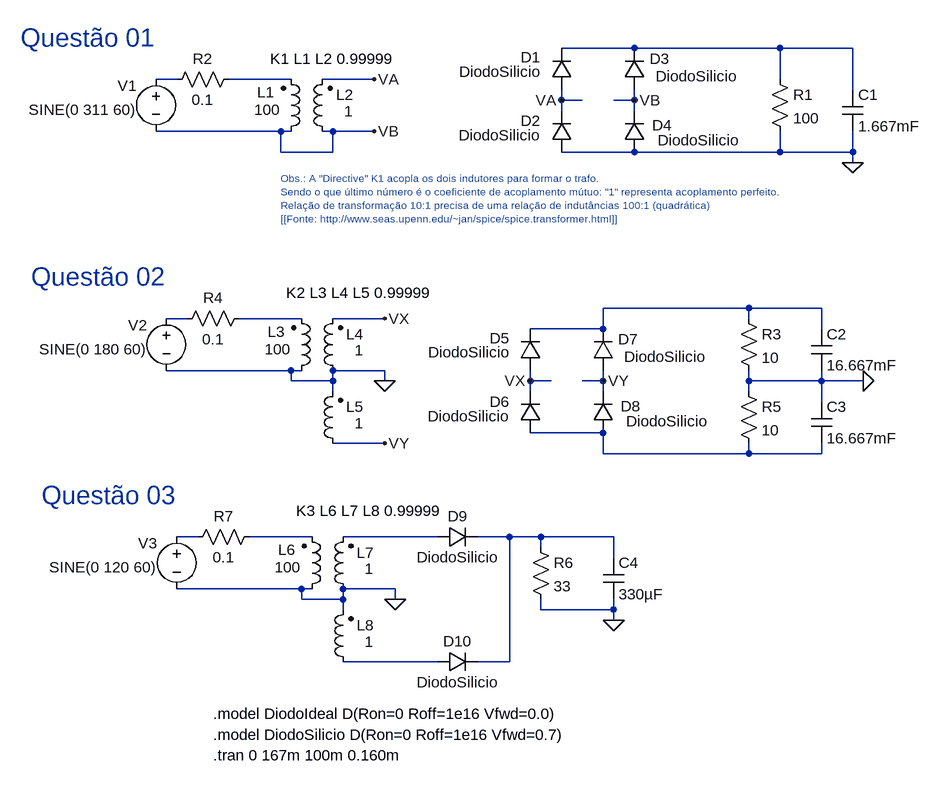
[diagram p0: schematic Tutorial_LTSpice_Ep8-Transformador.asc]
Tutorial_LTSpice_Ep8-Transformador.asc, the LTspice schematic file:
Version 4
SHEET 1 2300 1300
WIRE 672 -32 560 -32
WIRE 896 -32 672 -32
WIRE 1008 -32 896 -32
WIRE -32 16 -64 16
WIRE 144 16 48 16
WIRE 272 16 192 16
WIRE 896 16 896 -32
WIRE 1008 32 1008 -32
WIRE 560 48 560 32
WIRE 592 48 560 48
WIRE 672 48 672 32
WIRE 672 48 640 48
WIRE 560 64 560 48
WIRE 672 64 672 48
WIRE 128 96 -64 96
WIRE 144 96 128 96
WIRE 208 96 192 96
WIRE 272 96 208 96
WIRE 128 128 128 96
WIRE 208 128 208 96
WIRE 208 128 128 128
WIRE 672 128 560 128
WIRE 896 128 896 96
WIRE 896 128 672 128
WIRE 1008 128 1008 96
WIRE 1008 128 896 128
WIRE 1008 144 1008 128
WIRE 848 368 624 368
WIRE 960 368 848 368
WIRE -16 384 -48 384
WIRE 160 384 64 384
WIRE 288 384 208 384
WIRE 848 384 848 368
WIRE 624 400 624 368
WIRE 624 400 512 400
WIRE 960 400 960 368
WIRE 144 464 -48 464
WIRE 160 464 144 464
WIRE 288 464 208 464
WIRE 144 480 144 464
WIRE 208 480 208 464
WIRE 208 480 144 480
WIRE 288 480 288 464
WIRE 512 480 512 464
WIRE 544 480 512 480
WIRE 624 480 624 464
WIRE 624 480 592 480
WIRE 848 480 848 464
WIRE 960 480 960 464
WIRE 960 480 848 480
WIRE 1024 480 960 480
WIRE 208 496 208 480
WIRE 512 496 512 480
WIRE 624 496 624 480
WIRE 848 496 848 480
WIRE 960 512 960 480
WIRE 624 560 512 560
WIRE 288 576 208 576
WIRE 624 592 624 560
WIRE 848 592 848 576
WIRE 848 592 624 592
WIRE 960 592 960 576
WIRE 960 592 848 592
WIRE 0 720 -32 720
WIRE 176 720 80 720
WIRE 368 720 224 720
WIRE 480 720 432 720
WIRE 528 720 480 720
WIRE 640 720 528 720
WIRE 528 736 528 720
WIRE 640 752 640 720
WIRE 160 800 -32 800
WIRE 176 800 160 800
WIRE 304 800 224 800
WIRE 160 816 160 800
WIRE 224 816 224 800
WIRE 224 816 160 816
WIRE 304 816 304 800
WIRE 224 832 224 816
WIRE 528 832 528 816
WIRE 640 832 640 816
WIRE 640 832 528 832
WIRE 640 848 640 832
WIRE 368 912 224 912
WIRE 480 912 480 720
WIRE 480 912 432 912
FLAG 1008 144 0
FLAG 272 16 VA
FLAG 560 48 VA
FLAG 672 48 VB
FLAG 272 96 VB
FLAG 1024 480 0
FLAG 288 384 VX
FLAG 512 480 VX
FLAG 624 480 VY
FLAG 288 576 VY
FLAG 288 480 0
FLAG 640 848 0
FLAG 304 816 0
SYMBOL voltage -64 0 R0
WINDOW 123 0 0 Left 2
WINDOW 39 0 0 Left 2
WINDOW 0 -59 26 Left 2
WINDOW 3 -196 63 Left 2
SYMATTR InstName V1
SYMATTR Value SINE(0 311 60)
SYMBOL ind2 128 112 M180
WINDOW 0 -36 76 Left 2
WINDOW 3 -41 49 Left 2
SYMATTR InstName L1
SYMATTR Value 100
SYMATTR Type ind
SYMBOL ind2 208 112 R180
WINDOW 0 -32 72 Left 2
WINDOW 3 -31 47 Left 2
SYMATTR InstName L2
SYMATTR Value 1
SYMATTR Type ind
SYMATTR SpiceLine Rser=0
SYMBOL diode 576 32 R180
WINDOW 0 48 50 Left 2
WINDOW 3 48 28 Left 2
SYMATTR InstName D1
SYMATTR Value DiodoSilicio
SYMBOL diode 576 128 R180
WINDOW 0 48 48 Left 2
WINDOW 3 49 26 Left 2
SYMATTR InstName D2
SYMATTR Value DiodoSilicio
SYMBOL diode 688 32 R180
WINDOW 0 -38 48 Left 2
WINDOW 3 -142 21 Left 2
SYMATTR InstName D3
SYMATTR Value DiodoSilicio
SYMBOL diode 688 128 R180
WINDOW 0 -42 41 Left 2
WINDOW 3 -145 18 Left 2
SYMATTR InstName D4
SYMATTR Value DiodoSilicio
SYMBOL res 880 0 R0
SYMATTR InstName R1
SYMATTR Value 100
SYMBOL res 64 0 R90
WINDOW 0 0 56 VBottom 2
WINDOW 3 32 56 VTop 2
SYMATTR InstName R2
SYMATTR Value 0.1
SYMBOL cap 992 32 R0
SYMATTR InstName C1
SYMATTR Value 1.667mF
SYMBOL voltage -48 368 R0
WINDOW 123 0 0 Left 2
WINDOW 39 0 0 Left 2
WINDOW 0 -59 26 Left 2
WINDOW 3 -196 63 Left 2
SYMATTR InstName V2
SYMATTR Value SINE(0 180 60)
SYMBOL ind2 144 480 M180
WINDOW 0 -36 76 Left 2
WINDOW 3 -41 49 Left 2
SYMATTR InstName L3
SYMATTR Value 100
SYMATTR Type ind
SYMBOL ind2 224 480 R180
WINDOW 0 -32 72 Left 2
WINDOW 3 -31 47 Left 2
SYMATTR InstName L4
SYMATTR Value 1
SYMATTR Type ind
SYMATTR SpiceLine Rser=0
SYMBOL diode 528 464 R180
WINDOW 0 48 50 Left 2
WINDOW 3 48 28 Left 2
SYMATTR InstName D5
SYMATTR Value DiodoSilicio
SYMBOL diode 528 560 R180
WINDOW 0 48 48 Left 2
WINDOW 3 49 26 Left 2
SYMATTR InstName D6
SYMATTR Value DiodoSilicio
SYMBOL diode 640 464 R180
WINDOW 0 -38 48 Left 2
WINDOW 3 -142 21 Left 2
SYMATTR InstName D7
SYMATTR Value DiodoSilicio
SYMBOL diode 640 560 R180
WINDOW 0 -42 41 Left 2
WINDOW 3 -145 18 Left 2
SYMATTR InstName D8
SYMATTR Value DiodoSilicio
SYMBOL res 832 368 R0
SYMATTR InstName R3
SYMATTR Value 10
SYMBOL res 80 368 R90
WINDOW 0 0 56 VBottom 2
WINDOW 3 32 56 VTop 2
SYMATTR InstName R4
SYMATTR Value 0.1
SYMBOL cap 944 400 R0
SYMATTR InstName C2
SYMATTR Value 16.667mF
SYMBOL ind2 224 592 R180
WINDOW 0 -32 72 Left 2
WINDOW 3 -31 47 Left 2
SYMATTR InstName L5
SYMATTR Value 1
SYMATTR Type ind
SYMATTR SpiceLine Rser=0
SYMBOL res 832 480 R0
SYMATTR InstName R5
SYMATTR Value 10
SYMBOL cap 944 512 R0
SYMATTR InstName C3
SYMATTR Value 16.667mF
SYMBOL voltage -32 704 R0
WINDOW 123 0 0 Left 2
WINDOW 39 0 0 Left 2
WINDOW 0 -59 26 Left 2
WINDOW 3 -196 63 Left 2
SYMATTR InstName V3
SYMATTR Value SINE(0 120 60)
SYMBOL ind2 160 816 M180
WINDOW 0 -36 76 Left 2
WINDOW 3 -41 49 Left 2
SYMATTR InstName L6
SYMATTR Value 100
SYMATTR Type ind
SYMBOL ind2 240 816 R180
WINDOW 0 -32 72 Left 2
WINDOW 3 -31 47 Left 2
SYMATTR InstName L7
SYMATTR Value 1
SYMATTR Type ind
SYMATTR SpiceLine Rser=0
SYMBOL diode 368 736 R270
WINDOW 0 32 32 VTop 2
WINDOW 3 0 32 VBottom 2
SYMATTR InstName D9
SYMATTR Value DiodoSilicio
SYMBOL diode 368 928 R270
WINDOW 0 32 32 VTop 2
WINDOW 3 0 32 VBottom 2
SYMATTR InstName D10
SYMATTR Value DiodoSilicio
SYMBOL res 512 720 R0
SYMATTR InstName R6
SYMATTR Value 33
SYMBOL res 96 704 R90
WINDOW 0 0 56 VBottom 2
WINDOW 3 32 56 VTop 2
SYMATTR InstName R7
SYMATTR Value 0.1
SYMBOL cap 624 752 R0
SYMATTR InstName C4
SYMATTR Value 330µF
SYMBOL ind2 240 928 R180
WINDOW 0 -32 72 Left 2
WINDOW 3 -31 47 Left 2
SYMATTR InstName L8
SYMATTR Value 1
SYMATTR Type ind
SYMATTR SpiceLine Rser=0
TEXT 24 1056 Left 2 !.tran 0 167m 100m 0.160m
TEXT -272 -48 Left 4 ;Questão 01
TEXT 24 992 Left 2 !.model DiodoIdeal D(Ron=0 Roff=1e16 Vfwd=0.0)
TEXT 24 1024 Left 2 !.model DiodoSilicio D(Ron=0 Roff=1e16 Vfwd=0.7)
TEXT 112 -16 Left 2 !K1 L1 L2 0.99999
TEXT 128 168 Left 1 ;Obs.: A "Directive" K1 acopla os dois indutores para formar o trafo.\nSendo o que último número é o coeficiente de acoplamento mútuo: "1" representa acoplamento perfeito.\nRelação de transformação 10:1 precisa de uma relação de indutâncias 100:1 (quadrática)\n[[Fonte: http://www.seas.upenn.edu/~jan/spice/spice.transformer.html]]
TEXT -256 320 Left 4 ;Questão 02
TEXT 136 344 Left 2 !K2 L3 L4 L5 0.99999
TEXT -240 656 Left 4 ;Questão 03
TEXT 152 680 Left 2 !K3 L6 L7 L8 0.99999

The netlist it stands for:
* Tutorial_LTSpice_Ep8-Transformador.asc
V1 N002 VB SINE(0 311 60)
L1 VB N003 100
L2 VB VA 1 Rser=0
D1 VA N001 DiodoSilicio
D2 0 VA DiodoSilicio
D3 VB N001 DiodoSilicio
D4 0 VB DiodoSilicio
R1 N001 0 100
R2 N003 N002 0.1
C1 N001 0 1.667mF
V2 N005 0 SINE(0 180 60)
L3 0 N006 100
L4 0 VX 1 Rser=0
D5 VX N004 DiodoSilicio
D6 N007 VX DiodoSilicio
D7 VY N004 DiodoSilicio
D8 N007 VY DiodoSilicio
R3 N004 0 10
R4 N006 N005 0.1
C2 N004 0 16.667mF
L5 VY 0 1 Rser=0
R5 0 N007 10
C3 0 N007 16.667mF
V3 N008 0 SINE(0 120 60)
L6 0 N009 100
L7 0 N010 1 Rser=0
D9 N010 N011 DiodoSilicio
D10 N012 N011 DiodoSilicio
R6 N011 0 33
R7 N009 N008 0.1
C4 N011 0 330µF
L8 N012 0 1 Rser=0
.model D D
.lib standard.dio
.tran 0 167m 100m 0.160m
* Questão 01
.model DiodoIdeal D(Ron=0 Roff=1e16 Vfwd=0.0)
.model DiodoSilicio D(Ron=0 Roff=1e16 Vfwd=0.7)
K1 L1 L2 0.99999
* Obs.: A "Directive" K1 acopla os dois indutores para formar o trafo.
* Sendo o que último número é o coeficiente de acoplamento mútuo: "1" representa acoplamento perfeito.
* Relação de transformação 10:1 precisa de uma relação de indutâncias 100:1 (quadrática)
* [[Fonte: http://www.seas.upenn.edu/~jan/spice/spice.transformer.html]]
* Questão 02
K2 L3 L4 L5 0.99999
* Questão 03
K3 L6 L7 L8 0.99999
.backanno
.end